# Altium schematic sheet ISP_medium_main.SchDoc
size A4
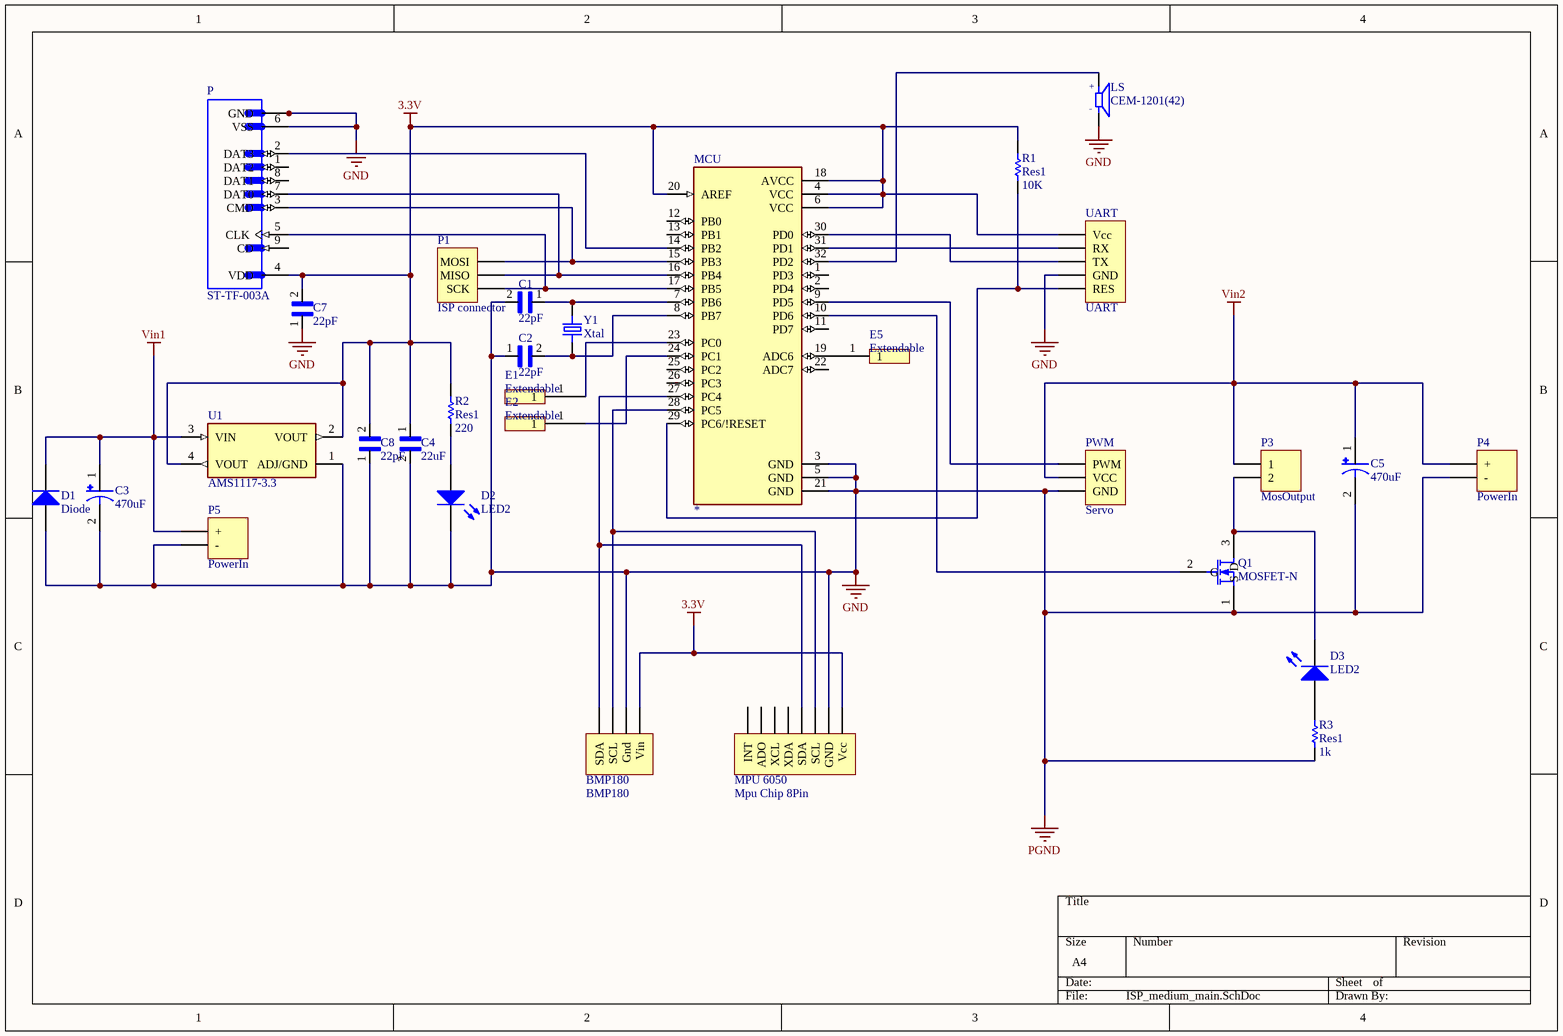
[diagram p0: ISP_medium_main.SchDoc]

## Parts
BMP180  BMP180  [BMP280]
C1  22pF  [CAP1602]
C2  22pF  [CAP1602]
C3  470uF  [CAPAE7066X77M]
C4  22uF  [CAP1602]
C5  470uF  [CAPAE7066X77M]
C7  22pF  [CAP1602]
C8  22pF  [CAP1602]
D1  Diode  [DIOM4227X24N]
D2  LED2  [3.2X1.6X1.1]
D3  LED2  [3.2X1.6X1.1]
E1  Extendable  [Extendable]
E2  Extendable  [Extendable]
E5  Extendable  [Extendable]
LS  CEM-1201(42)  [CUI_CEM-1201(42)]
MCU  *  [QFP80P900X900X120-32N]
MPU_6050  Mpu Chip 8Pin  [Mpu 8Pin]
P  ST-TF-003A  [MicroSD]
P1  ISP connector  [ISP connector]
P3  MosOutput  [KF126-2P-Connector]
P4  PowerIn  [PowerIn]
P5  PowerIn  [PowerIn]
PWM  Servo  [Servo]
Q1  MOSFET-N  [SOT23-3]
R1  Res1  value 10K  [RES 1602]
R2  Res1  value 220  [RES 1602]
R3  Res1  value 1k  [RES 1602]
U1  AMS1117-3.3  [SOT230P700X180-4N]
UART  UART  [UART]
Y1  Xtal  [XTAL]

## Nets
3.3V: BMP180.1(Vin) C4.1 C7.2 C8.2 MCU.4(VCC) MCU.6(VCC) MCU.18(AVCC) MCU.20(AREF) MPU_6050.1(Vcc) P.4(VDD) R1.2 R2.2 U1.2(VOUT) U1.4(VOUT) UART.1(Vcc)
GND: BMP180.2(Gnd) C1.2 C2.1 C3.2(-) C4.2 C5.2(-) C7.1 C8.1 D1.1(A) D2.2(K) LS.M MCU.3(GND) MCU.5(GND) MCU.21(GND) MPU_6050.2(GND) P.6(VSS) P.G1(GND) P.G2(GND) P.G3(GND) P.G4(GND) P4.2(-) P5.2(-) PWM.3(GND) Q1.1(S) R3.1 U1.1(ADJ/GND) UART.4(GND)  [also labelled PGND]
Vin1: C3.1(+) D1.2(K) P5.1(+) U1.3(VIN)
Vin2: C5.1(+) P3.1 P4.1(+) PWM.2(VCC)
NetBMP180_3: BMP180.3(SCL) MCU.28(PC5) MPU_6050.3(SCL)
NetBMP180_4: BMP180.4(SDA) MCU.27(PC4) MPU_6050.4(SDA)
NetC1_1: C1.1 MCU.7(PB6) Y1.2
NetC2_2: C2.2 MCU.8(PB7) Y1.1
NetD2_1: D2.1(A) R2.1
NetD3_1: D3.1(A) R3.2
NetD3_2: D3.2(K) P3.2 Q1.3(D)
NetE1_1: E1.1 MCU.23(PC0)
NetE2_1: E2.1 MCU.24(PC1)
NetE5_1: E5.1 MCU.19(ADC6)
NetLS_P: LS.P MCU.32(PD2)
NetMCU_9: MCU.9(PD5) PWM.1(PWM)
NetMCU_10: MCU.10(PD6) Q1.2(G)
NetMCU_14: MCU.14(PB2) P.2(DAT3)
NetMCU_15: MCU.15(PB3) P.3(CMD) P1.3(MOSI)
NetMCU_16: MCU.16(PB4) P.7(DAT0) P1.2(MISO)
NetMCU_17: MCU.17(PB5) P.5(CLK) P1.1(SCK)
NetMCU_29: MCU.29(PC6/!RESET) R1.1 UART.5(RES)
NetMCU_30: MCU.30(PD0) UART.3(TX)
NetMCU_31: MCU.31(PD1) UART.2(RX)

Not connected (* = marked no-connect by the designer): MCU 1(PD3) 2(PD4) 11(PD7) 12(PB0) 13(PB1) 22(ADC7) 25(PC2) 26(PC3); MPU_6050 5(XDA) 6(XCL) 7(ADO) 8(INT); P 1(DAT2) 8(DAT1) 9(CD)

## Notes on the sheet
- (in symbol CEM-1201(42)) +; -

## Library data of the parts
BMP180 = BMP180: Chip Connector 4 Pin for BMP180; LatestRevisionDate: 17-Jul-2002; LatestRevisionNote: Re-released for DXP Platform.; Publisher: Altium Limited
C1 C2 C7 C8 = 22pF: SMD Capacitor X6S(EIA) with Capacitance: 22pF; MF: Murata; MP: GRM319C81C106MA12J; Value: *; Price: None; Package: 1206 Murata; SnapEDA_Link: https://www.snapeda.com/parts/GRM319C81C106MA12J/Murata/view-part/1894707/?ref=snap; Availability: Warning; Purchase-URL: https://pricing.snapeda.com/search/part/GRM319C81C106MA12J/?ref=eda; Check_prices: https://www.snapeda.com/parts/GRM319C81C106MA12J/Murata/view-part/1894707/?ref=eda
C3 C5 = 470uF: 470µF 16V Aluminum Electrolytic Capacitors Radial; MF: Panasonic; MP: EEE-FC1C471AP; Value: *; Package: Radial Panasonic; Availability: Unavailable; SnapEDA_Link: https://www.snapeda.com/parts/EEE-FC1C471AP/Panasonic%20Electronic%20Components/view-part/51969/?ref=snap; Price: None
C4 = 100nF: SMD Capacitor X6S(EIA) with Capacitance: 22pF; MF: Murata; MP: GRM319C81C106MA12J; Value: *; Price: None; Package: 1206 Murata; SnapEDA_Link: https://www.snapeda.com/parts/GRM319C81C106MA12J/Murata/view-part/1894707/?ref=snap; Availability: Warning; Purchase-URL: https://pricing.snapeda.com/search/part/GRM319C81C106MA12J/?ref=eda; Check_prices: https://www.snapeda.com/parts/GRM319C81C106MA12J/Murata/view-part/1894707/?ref=eda
D1 = Diode: Default Diode; Published: 8-Jun-2000; LatestRevisionDate: 17-Jul-2002; LatestRevisionNote: Re-released for DXP Platform.; PackageVersion: Sep-1996; PackageReference: SMC; Publisher: Altium Limited; PackageDescription: DO-214-AB/SMC; 2 C-Bend Leads; Body 7.9 x 5.9 mm, inc. leads (LxW); Code_JEDEC: DO-214-AB
D2 D3 = LED2: Typical RED, GREEN, YELLOW, AMBER GaAs LED; Published: 8-Jun-2000; LatestRevisionDate: 17-Jul-2002; LatestRevisionNote: Re-released for DXP Platform.; PackageVersion: Feb-2002; PackageReference: 3.2X1.6X1.1; Publisher: Altium Limited; PackageDescription: SM LED; 2 Flat Leads
LS = CEM-1201(42): 12 mm, 1,5 V, 85 dB, furo passante, campainha elÃ©trica transdutora de Ã¡udio magnÃ©tica; MF: CUI Devices; MP: CEM-1201_42_; CUI_purchase_URL: https://www.cuidevices.com/product/audio/buzzers/audio-transducers/cem-1201_42_?utm_source=snapeda.com&utm_medium=referral&utm_campaign=snapedaBOM; Price: None; SnapEDA_Link: https://www.snapeda.com/parts/CEM-1201%2842%29/CUI%20Devices/view-part/2755977/?ref=snap; Value: *; Availability: Unavailable; Package: CUI Inc.
MCU = ATMEGA328P-AU: AVR AVRÂ® ATmega Microcontroller IC 8-Bit 20MHz 32KB _16K x 16_ FLASH 32-TQFP _7x7_; MF: Microchip Technology; MP: ATMEGA328P-AU; Availability: Unavailable; Package: TQFP-32 Microchip Technology; Value: *; Price: None; SnapEDA_Link: https://www.snapeda.com/parts/ATMEGA328P-AU/Microchip/view-part/4593405/?ref=snap
MPU_6050 = Chip Mpu 8Pin: LatestRevisionDate: 17-Jul-2002; LatestRevisionNote: Re-released for DXP Platform.; Publisher: Altium Limited
P = ST-TF-003A: Micro SD Card Socket; MF: Suntech; Value: *; Price: None; Package: None; SnapEDA_Link: https://www.snapeda.com/parts/ST-TF-003A/Suntech/view-part/214778/?ref=snap; Availability: Unavailable; MP: ST-TF-003A
P1 = ISP connector: Header, 3-Pin; LatestRevisionDate: 17-Jul-2002; LatestRevisionNote: Re-released for DXP Platform.; Publisher: Altium Limited
P3 = MosOutput: Header, 2-Pin; LatestRevisionDate: 17-Jul-2002; LatestRevisionNote: Re-released for DXP Platform.; Publisher: Altium Limited
P4 P5 = PowerIn: Header, 2-Pin; LatestRevisionDate: 17-Jul-2002; LatestRevisionNote: Re-released for DXP Platform.; Publisher: Altium Limited
PWM = Servo: Header, 3-Pin; LatestRevisionDate: 17-Jul-2002; LatestRevisionNote: Re-released for DXP Platform.; Publisher: Altium Limited
Q1 = MOSFET-N: N-Channel MOSFET; pin to pad: 1>2 2>1; Published: 8-Jun-2000; LatestRevisionDate: 17-Jul-2002; LatestRevisionNote: Re-released for DXP Platform.; PackageVersion: 1995/1996; PackageReference: E3; Publisher: Altium Limited; PackageDescription: TO, Flat Index; 3 In-Line, Axial Leads; Body Dia. 4.6mm; Lead Dia. 0.5 mm (max)
R1-R3 = Res1: Resistor; Published: 8-Jun-2000; LatestRevisionDate: 17-Jul-2002; LatestRevisionNote: Re-released for DXP Platform.; PackageReference: AXIAL-0.3; Publisher: Altium Limited; PackageDescription: Axial Device, Thru-Hole; 2 Leads; 0.3 in Pin Spacing
U1 = AMS1117-3.3: Sot223/Pkg 1-Amp 3.3-Volt Low Drop Out Voltage Regulatator; MF: Advanced Monolithic Systems; Price: None; Package: None; Value: *; MP: AMS1117-3.3; Availability: Unavailable; SnapEDA_Link: https://www.snapeda.com/parts/AMS1117-3.3/Advanced%20Monolithic%20Systems/view-part/53450/?ref=snap
UART = UART: Header, 5-Pin, UART, for uploading; LatestRevisionDate: 17-Jul-2002; LatestRevisionNote: Re-released for DXP Platform.; Publisher: Altium Limited
Y1 = Xtal: MP: ECS-122.8-18-5PXEN-TR; MF: ECS Inc.; DigiKey-Purchase-URL: https://snapeda.com/shop?store=DigiKey&id=2461451; Availability: Good; Arrow_Electronics-Purchase-URL: https://snapeda.com/shop?store=Arrow+Electronics&id=2461451; Package: HC49/US ECS International; Mouser-Purchase-URL: https://snapeda.com/shop?store=Mouser&id=2461451; Value: *; SnapEDA_Link: https://www.snapeda.com/parts/ECS-122.8-18-5PXEN-TR/ECS%20Inc./view-part/2461451/?ref=snap; Price: None